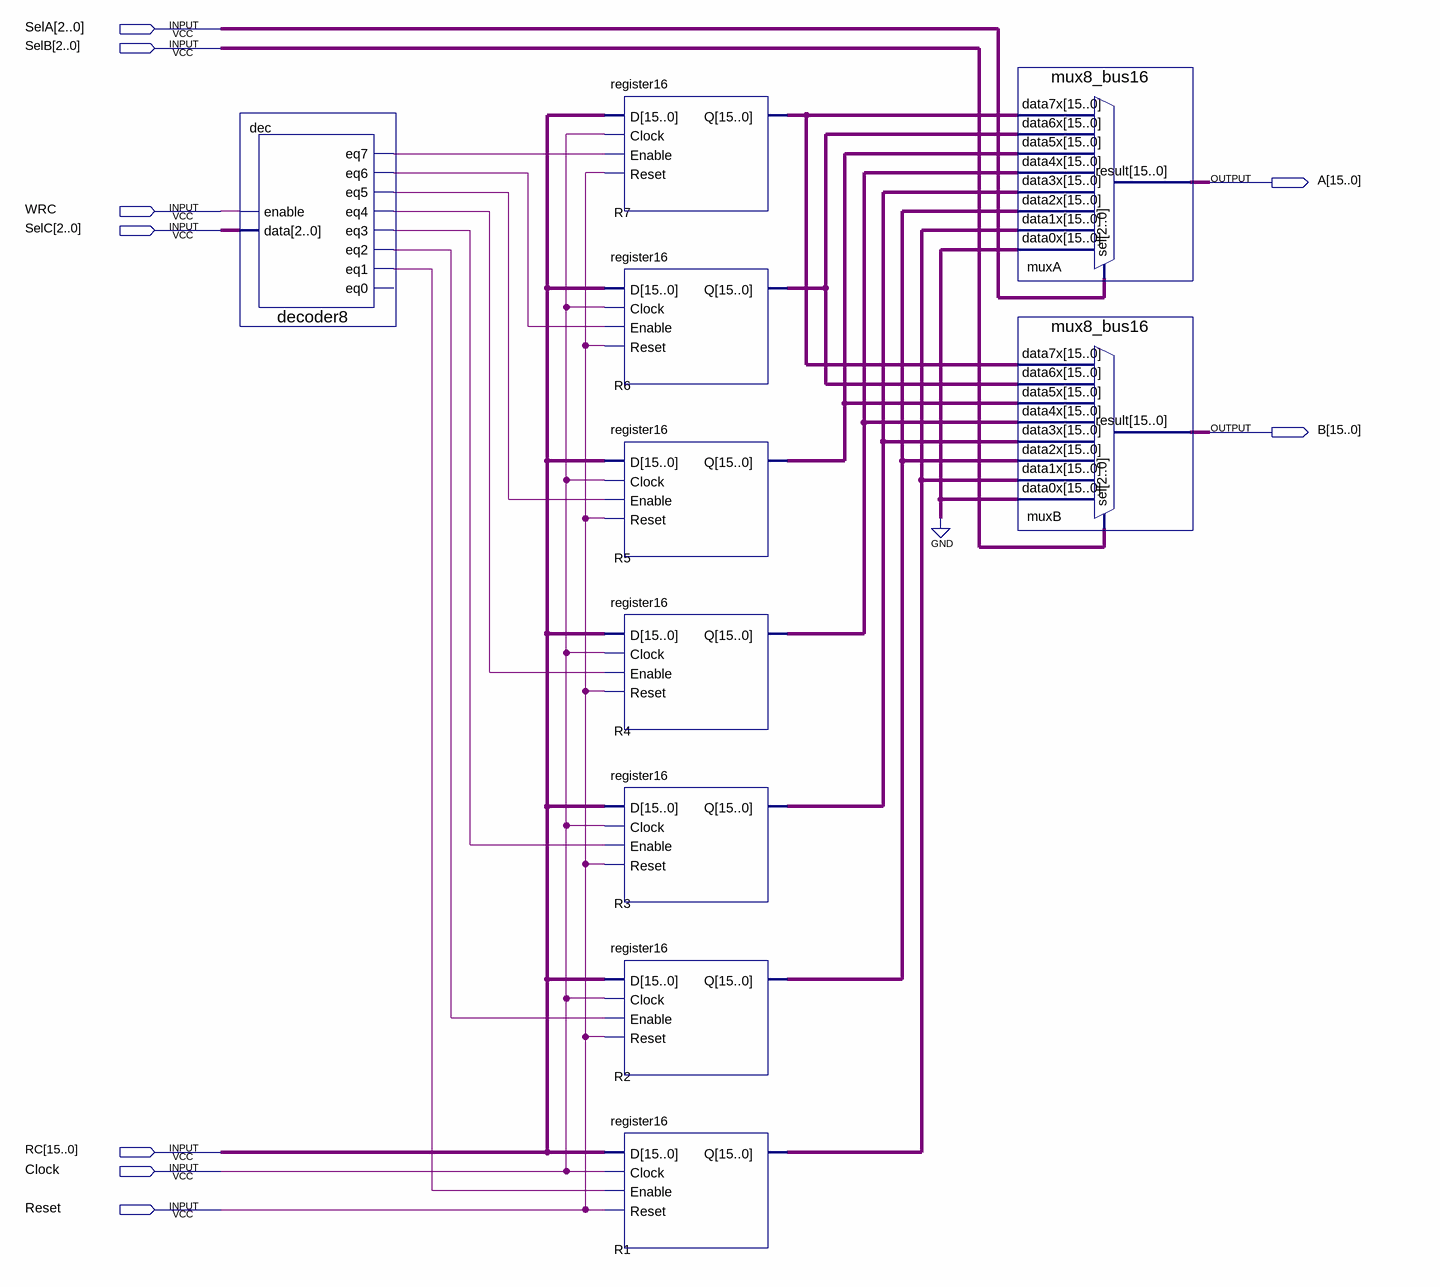
[diagram p0: schematic sheet]
// Quartus schematic register_bank.bdf as structural Verilog: 10 symbols, 9 pins
module register_bank (
  input  [2:0] SelA,
  input  [2:0] SelB,
  input  WRC,
  input  [2:0] SelC,
  input  [15:0] RC,
  input  Clock,
  input  Reset,
  output [15:0] A,
  output [15:0] B
);

  wire dec_eq1, dec_eq2, dec_eq3, dec_eq4, dec_eq5, dec_eq6, dec_eq7;
  wire [15:0] R1_q, R2_q, R3_q, R4_q, R5_q, R6_q, R7_q;

  decoder8 dec (
    .data(SelC), .enable(WRC), .eq1(dec_eq1), .eq2(dec_eq2), .eq3(dec_eq3), .eq4(dec_eq4), .eq5(dec_eq5),
    .eq6(dec_eq6), .eq7(dec_eq7));  // open: eq0
  register16 R7 (.D(RC), .Clock(Clock), .Enable(dec_eq7), .Reset(Reset), .Q(R7_q));
  register16 R6 (.D(RC), .Clock(Clock), .Enable(dec_eq6), .Reset(Reset), .Q(R6_q));
  register16 R5 (.D(RC), .Clock(Clock), .Enable(dec_eq5), .Reset(Reset), .Q(R5_q));
  register16 R4 (.D(RC), .Clock(Clock), .Enable(dec_eq4), .Reset(Reset), .Q(R4_q));
  register16 R3 (.D(RC), .Clock(Clock), .Enable(dec_eq3), .Reset(Reset), .Q(R3_q));
  register16 R2 (.D(RC), .Clock(Clock), .Enable(dec_eq2), .Reset(Reset), .Q(R2_q));
  register16 R1 (.D(RC), .Clock(Clock), .Enable(dec_eq1), .Reset(Reset), .Q(R1_q));
  mux8_bus16 muxA (
    .data7x(R7_q), .data6x(R6_q), .data5x(R5_q), .data4x(R4_q), .data3x(R3_q), .data2x(R2_q), .data1x(R1_q),
    .data0x({16{1'b0}}), .sel(SelA), .result(A));
  mux8_bus16 muxB (
    .data7x(R7_q), .data6x(R6_q), .data5x(R5_q), .data4x(R4_q), .data3x(R3_q), .data2x(R2_q), .data1x(R1_q),
    .data0x({16{1'b0}}), .sel(SelB), .result(B));
endmodule
